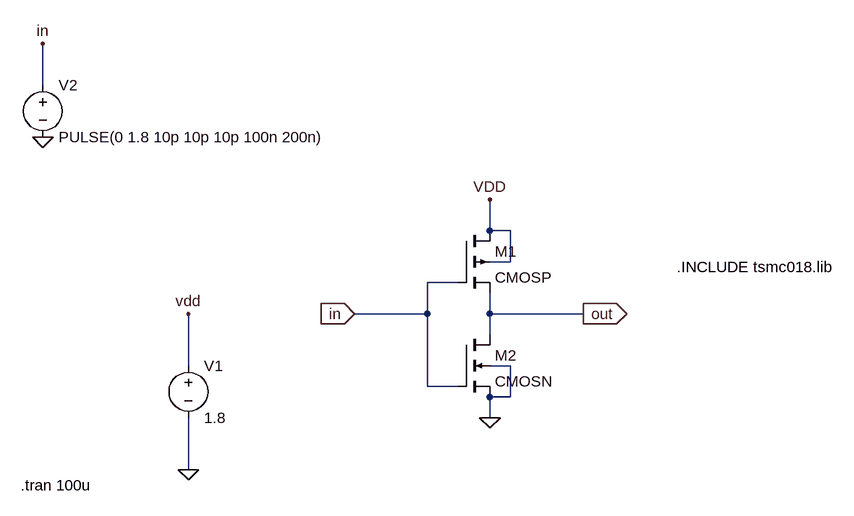
[diagram p0: schematic inverter_test.asc]
inverter_test.asc, the LTspice schematic file:
Version 4
SHEET 1 880 680
WIRE -528 -160 -528 -224
WIRE 160 64 160 16
WIRE 192 64 160 64
WIRE 192 112 192 64
WIRE 192 112 160 112
WIRE 112 144 64 144
WIRE 64 192 64 144
WIRE 64 192 -48 192
WIRE 160 192 160 160
WIRE 304 192 160 192
WIRE 160 224 160 192
WIRE -304 272 -304 192
WIRE 192 272 160 272
WIRE 64 304 64 192
WIRE 112 304 64 304
WIRE 192 320 192 272
WIRE 192 320 160 320
WIRE 160 352 160 320
WIRE -304 432 -304 352
FLAG 160 16 VDD
FLAG 160 352 0
FLAG -48 192 in
IOPIN -48 192 In
FLAG 304 192 out
IOPIN 304 192 Out
FLAG -304 432 0
FLAG -304 192 vdd
FLAG -528 -80 0
FLAG -528 -224 in
SYMBOL cmosp 112 64 R0
SYMATTR InstName M1
SYMATTR Value2 l=180n w=360n
SYMBOL cmosn 112 224 R0
SYMATTR InstName M2
SYMATTR Value2 l=180n w=180n
SYMBOL voltage -304 256 R0
WINDOW 123 0 0 Left 0
WINDOW 39 0 0 Left 0
SYMATTR InstName V1
SYMATTR Value 1.8
SYMBOL voltage -528 -176 R0
WINDOW 123 0 0 Left 0
WINDOW 39 0 0 Left 0
SYMATTR InstName V2
SYMATTR Value PULSE(0 1.8 10p 10p 10p 100n 200n)
TEXT 448 120 Left 2 !.INCLUDE tsmc018.lib
TEXT -562 456 Left 2 !.tran 100u

The netlist it stands for:
* inverter_test.asc
M1 VDD in out VDD CMOSP l=180n w=360n
M2 out in 0 0 CMOSN l=180n w=180n
V1 VDD 0 1.8
V2 in 0 PULSE(0 1.8 10p 10p 10p 100n 200n)
.model NMOS NMOS
.model PMOS PMOS
.lib standard.mos
.INCLUDE tsmc018.lib
.tran 100u
.backanno
.end